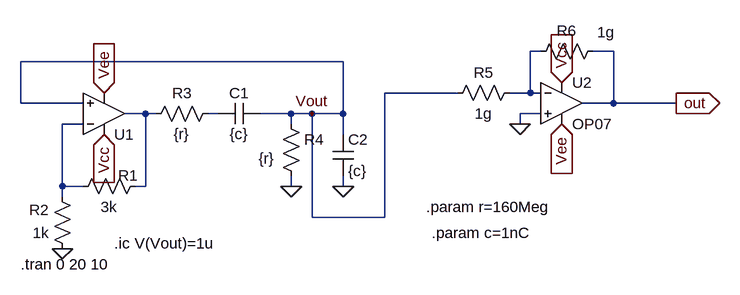
[diagram p0: schematic input_3.asc]
input_3.asc, the LTspice schematic file:
Version 4.1
SHEET 1 1140 680
WIRE 400 -16 384 -16
WIRE 512 -16 480 -16
WIRE 96 0 -400 0
WIRE 272 48 160 48
WIRE 384 48 384 -16
WIRE 384 48 352 48
WIRE 400 48 384 48
WIRE -400 64 -400 0
WIRE -304 64 -400 64
WIRE 512 64 512 -16
WIRE 512 64 464 64
WIRE 608 64 512 64
WIRE -208 80 -240 80
WIRE -192 80 -208 80
WIRE -96 80 -112 80
WIRE 16 80 -32 80
WIRE 48 80 16 80
WIRE 96 80 96 0
WIRE 96 80 48 80
WIRE 400 80 368 80
WIRE -304 96 -336 96
WIRE 16 96 16 80
WIRE 368 96 368 80
WIRE 96 112 96 80
WIRE -336 192 -336 96
WIRE -304 192 -336 192
WIRE -208 192 -208 80
WIRE -208 192 -224 192
WIRE 16 192 16 176
WIRE 96 192 96 176
WIRE -336 208 -336 192
WIRE 48 240 48 80
WIRE 160 240 160 48
WIRE 160 240 48 240
FLAG -336 288 0
FLAG 48 80 Vout
FLAG 16 192 0
FLAG 96 192 0
FLAG -272 112 Vcc
IOPIN -272 112 In
FLAG -272 48 Vee
IOPIN -272 48 In
FLAG 368 96 0
FLAG 432 32 Vcc
IOPIN 432 32 In
FLAG 432 96 Vee
IOPIN 432 96 In
FLAG 608 64 out
IOPIN 608 64 Out
SYMBOL Opamps\\UniversalOpamp2 -272 80 M180
SYMATTR InstName U1
SYMBOL res -208 176 R90
WINDOW 0 15 27 VBottom 2
WINDOW 3 32 56 VTop 2
SYMATTR InstName R1
SYMATTR Value 3k
SYMBOL res -320 304 R180
WINDOW 0 36 76 Left 2
WINDOW 3 36 40 Left 2
SYMATTR InstName R2
SYMATTR Value 1k
SYMBOL res -96 64 R90
WINDOW 0 0 56 VBottom 2
WINDOW 3 32 56 VTop 2
SYMATTR InstName R3
SYMATTR Value {r}
SYMBOL cap -32 64 R90
WINDOW 0 0 32 VBottom 2
WINDOW 3 32 32 VTop 2
SYMATTR InstName C1
SYMATTR Value {c}
SYMBOL res 0 80 R0
WINDOW 3 -34 69 Left 2
SYMATTR Value {r}
SYMATTR InstName R4
SYMBOL cap 80 112 R0
SYMATTR InstName C2
SYMATTR Value {c}
SYMBOL OpAmps\\OP07 432 0 R0
SYMATTR InstName U2
SYMBOL res 368 32 R90
WINDOW 0 0 56 VBottom 2
WINDOW 3 32 56 VTop 2
SYMATTR InstName R5
SYMATTR Value 1g
SYMBOL res 496 -32 R90
WINDOW 0 0 56 VBottom 2
WINDOW 3 -29 -4 VTop 2
SYMATTR InstName R6
SYMATTR Value 1g
TEXT -256 280 Left 2 !.ic V(Vout)=1u
TEXT 224 224 Left 2 !.param r=160Meg
TEXT 232 264 Left 2 !.param c=1nC
TEXT -400 312 Left 2 !.tran 0 20 10

The netlist it stands for:
* input_3.asc
X§U1 Vout N004 Vcc Vee N002 level.2 Avol=1Meg GBW=10Meg Slew=10Meg ilimit=25m rail=0 Vos=0 phimargin=45 en=0 enk=0 in=0 ink=0 Rin=500Meg  ; pins IN+ IN- V+ V- OUT
R1 N002 N004 3k
R2 0 N004 1k
R3 N003 N002 {r}
C1 Vout N003 {c}
R4 Vout 0 {r}
C2 Vout 0 {c}
X§U2 0 N001 Vcc Vee out LT1001  ; OP07, pins In+ In- V+ V- OUT
R5 N001 Vout 1g
R6 out N001 1g
.ic V(Vout)=1u
.param r=160Meg
.param c=1nC
.tran 0 20 10
.lib UniversalOpamps2.sub
.lib LTC.lib
.backanno
.end